# Altium schematic sheet InverterTranslation.SchDoc: Inverter Level Translation
size Letter; Engineer: Nathan Petersen; DocumentNumber: 13; Revision: v1.2; SheetNumber: 13; SheetTotal: 23
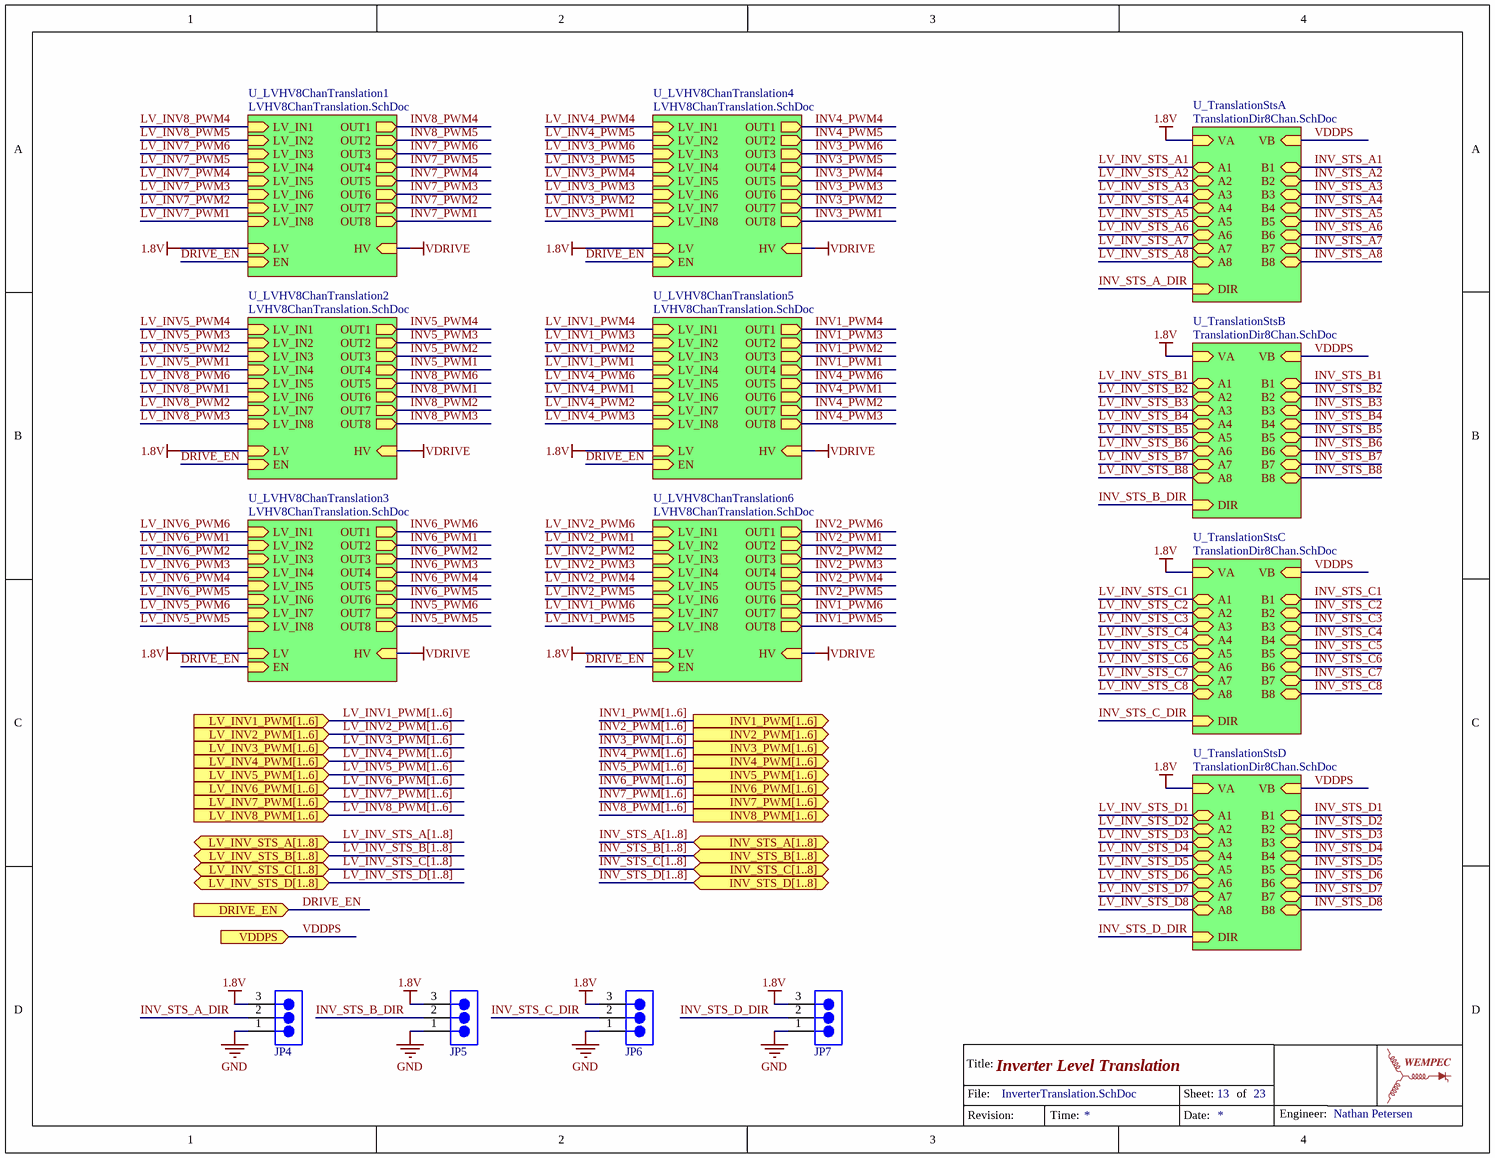
[diagram p0: InverterTranslation.SchDoc]

## Parts
JP4  Jumper3  [PIN_HEADER_1X3]  (value not drawn)
JP5  Jumper3  [PIN_HEADER_1X3]  (value not drawn)
JP6  Jumper3  [PIN_HEADER_1X3]  (value not drawn)
JP7  Jumper3  [PIN_HEADER_1X3]  (value not drawn)

## Sub-sheets
U_LVHV8ChanTranslation1 = LVHV8ChanTranslation.SchDoc: LV_IN1 (in), LV (in), HV (in), EN (in), OUT1 (out), OUT2 (out), OUT3 (out), OUT4 (out), LV_IN2 (in), LV_IN3 (in), LV_IN4 (in), LV_IN5 (in), LV_IN6 (in), LV_IN7 (in), LV_IN8 (in), OUT5 (out), OUT6 (out), OUT7 (out), OUT8 (out)
U_LVHV8ChanTranslation2 = LVHV8ChanTranslation.SchDoc: LV_IN1 (in), LV (in), HV (in), EN (in), OUT1 (out), OUT2 (out), OUT3 (out), OUT4 (out), LV_IN2 (in), LV_IN3 (in), LV_IN4 (in), LV_IN5 (in), LV_IN6 (in), LV_IN7 (in), LV_IN8 (in), OUT5 (out), OUT6 (out), OUT7 (out), OUT8 (out)
U_LVHV8ChanTranslation3 = LVHV8ChanTranslation.SchDoc: LV_IN1 (in), LV (in), HV (in), EN (in), OUT1 (out), OUT2 (out), OUT3 (out), OUT4 (out), LV_IN2 (in), LV_IN3 (in), LV_IN4 (in), LV_IN5 (in), LV_IN6 (in), LV_IN7 (in), LV_IN8 (in), OUT5 (out), OUT6 (out), OUT7 (out), OUT8 (out)
U_LVHV8ChanTranslation4 = LVHV8ChanTranslation.SchDoc: LV_IN1 (in), LV (in), HV (in), EN (in), OUT1 (out), OUT2 (out), OUT3 (out), OUT4 (out), LV_IN2 (in), LV_IN3 (in), LV_IN4 (in), LV_IN5 (in), LV_IN6 (in), LV_IN7 (in), LV_IN8 (in), OUT5 (out), OUT6 (out), OUT7 (out), OUT8 (out)
U_LVHV8ChanTranslation5 = LVHV8ChanTranslation.SchDoc: LV_IN1 (in), LV (in), HV (in), EN (in), OUT1 (out), OUT2 (out), OUT3 (out), OUT4 (out), LV_IN2 (in), LV_IN3 (in), LV_IN4 (in), LV_IN5 (in), LV_IN6 (in), LV_IN7 (in), LV_IN8 (in), OUT5 (out), OUT6 (out), OUT7 (out), OUT8 (out)
U_LVHV8ChanTranslation6 = LVHV8ChanTranslation.SchDoc: LV_IN1 (in), LV (in), HV (in), EN (in), OUT1 (out), OUT2 (out), OUT3 (out), OUT4 (out), LV_IN2 (in), LV_IN3 (in), LV_IN4 (in), LV_IN5 (in), LV_IN6 (in), LV_IN7 (in), LV_IN8 (in), OUT5 (out), OUT6 (out), OUT7 (out), OUT8 (out)
U_TranslationStsA = TranslationDir8Chan.SchDoc: VB (in), VA (in), B1 (bidir), B2 (bidir), B3 (bidir), B4 (bidir), B5 (bidir), B6 (bidir), B7 (bidir), B8 (bidir), A1 (bidir), A2 (bidir), A3 (bidir), A4 (bidir), A5 (bidir), A6 (bidir), A7 (bidir), A8 (bidir), DIR (in)
U_TranslationStsB = TranslationDir8Chan.SchDoc: VB (in), VA (in), B1 (bidir), B2 (bidir), B3 (bidir), B4 (bidir), B5 (bidir), B6 (bidir), B7 (bidir), B8 (bidir), A1 (bidir), A2 (bidir), A3 (bidir), A4 (bidir), A5 (bidir), A6 (bidir), A7 (bidir), A8 (bidir), DIR (in)
U_TranslationStsC = TranslationDir8Chan.SchDoc: VB (in), VA (in), B1 (bidir), B2 (bidir), B3 (bidir), B4 (bidir), B5 (bidir), B6 (bidir), B7 (bidir), B8 (bidir), A1 (bidir), A2 (bidir), A3 (bidir), A4 (bidir), A5 (bidir), A6 (bidir), A7 (bidir), A8 (bidir), DIR (in)
U_TranslationStsD = TranslationDir8Chan.SchDoc: VB (in), VA (in), B1 (bidir), B2 (bidir), B3 (bidir), B4 (bidir), B5 (bidir), B6 (bidir), B7 (bidir), B8 (bidir), A1 (bidir), A2 (bidir), A3 (bidir), A4 (bidir), A5 (bidir), A6 (bidir), A7 (bidir), A8 (bidir), DIR (in)

## Ports
DRIVE_EN (in), INV1_PWM[1..6] (out), INV2_PWM[1..6] (out), INV3_PWM[1..6] (out), INV4_PWM[1..6] (out), INV5_PWM[1..6] (out), INV6_PWM[1..6] (out), INV7_PWM[1..6] (out), INV8_PWM[1..6] (out), INV_STS_A[1..8] (bidir), INV_STS_B[1..8] (bidir), INV_STS_C[1..8] (bidir), INV_STS_D[1..8] (bidir), LV_INV1_PWM[1..6] (in), LV_INV2_PWM[1..6] (in), LV_INV3_PWM[1..6] (in), LV_INV4_PWM[1..6] (in), LV_INV5_PWM[1..6] (in), LV_INV6_PWM[1..6] (in), LV_INV7_PWM[1..6] (in), LV_INV8_PWM[1..6] (in), LV_INV_STS_A[1..8] (bidir), LV_INV_STS_B[1..8] (bidir), LV_INV_STS_C[1..8] (bidir), LV_INV_STS_D[1..8] (bidir), VDDPS (in)

## Nets
1.8V: JP4.3 JP5.3 JP6.3 JP7.3 ; sheet U_LVHV8ChanTranslation1/LV, sheet U_LVHV8ChanTranslation2/LV, sheet U_LVHV8ChanTranslation3/LV, sheet U_LVHV8ChanTranslation4/LV, sheet U_LVHV8ChanTranslation5/LV, sheet U_LVHV8ChanTranslation6/LV, sheet U_TranslationStsA/VA, sheet U_TranslationStsB/VA, sheet U_TranslationStsC/VA, sheet U_TranslationStsD/VA
GND: JP4.1 JP5.1 JP6.1 JP7.1
VDRIVE: sheet U_LVHV8ChanTranslation1/HV, sheet U_LVHV8ChanTranslation2/HV, sheet U_LVHV8ChanTranslation3/HV, sheet U_LVHV8ChanTranslation4/HV, sheet U_LVHV8ChanTranslation5/HV, sheet U_LVHV8ChanTranslation6/HV
DRIVE_EN: port DRIVE_EN, sheet U_LVHV8ChanTranslation1/EN, sheet U_LVHV8ChanTranslation2/EN, sheet U_LVHV8ChanTranslation3/EN, sheet U_LVHV8ChanTranslation4/EN, sheet U_LVHV8ChanTranslation5/EN, sheet U_LVHV8ChanTranslation6/EN
INV1_PWM1: sheet U_LVHV8ChanTranslation5/OUT4
INV1_PWM2: sheet U_LVHV8ChanTranslation5/OUT3
INV1_PWM3: sheet U_LVHV8ChanTranslation5/OUT2
INV1_PWM4: sheet U_LVHV8ChanTranslation5/OUT1
INV1_PWM5: sheet U_LVHV8ChanTranslation6/OUT8
INV1_PWM6: sheet U_LVHV8ChanTranslation6/OUT7
INV2_PWM1: sheet U_LVHV8ChanTranslation6/OUT2
INV2_PWM2: sheet U_LVHV8ChanTranslation6/OUT3
INV2_PWM3: sheet U_LVHV8ChanTranslation6/OUT4
INV2_PWM4: sheet U_LVHV8ChanTranslation6/OUT5
INV2_PWM5: sheet U_LVHV8ChanTranslation6/OUT6
INV2_PWM6: sheet U_LVHV8ChanTranslation6/OUT1
INV3_PWM1: sheet U_LVHV8ChanTranslation4/OUT8
INV3_PWM2: sheet U_LVHV8ChanTranslation4/OUT7
INV3_PWM3: sheet U_LVHV8ChanTranslation4/OUT6
INV3_PWM4: sheet U_LVHV8ChanTranslation4/OUT5
INV3_PWM5: sheet U_LVHV8ChanTranslation4/OUT4
INV3_PWM6: sheet U_LVHV8ChanTranslation4/OUT3
INV4_PWM1: sheet U_LVHV8ChanTranslation5/OUT6
INV4_PWM2: sheet U_LVHV8ChanTranslation5/OUT7
INV4_PWM3: sheet U_LVHV8ChanTranslation5/OUT8
INV4_PWM4: sheet U_LVHV8ChanTranslation4/OUT1
INV4_PWM5: sheet U_LVHV8ChanTranslation4/OUT2
INV4_PWM6: sheet U_LVHV8ChanTranslation5/OUT5
INV5_PWM1: sheet U_LVHV8ChanTranslation2/OUT4
INV5_PWM2: sheet U_LVHV8ChanTranslation2/OUT3
INV5_PWM3: sheet U_LVHV8ChanTranslation2/OUT2
INV5_PWM4: sheet U_LVHV8ChanTranslation2/OUT1
INV5_PWM5: sheet U_LVHV8ChanTranslation3/OUT8
INV5_PWM6: sheet U_LVHV8ChanTranslation3/OUT7
INV6_PWM1: sheet U_LVHV8ChanTranslation3/OUT2
INV6_PWM2: sheet U_LVHV8ChanTranslation3/OUT3
INV6_PWM3: sheet U_LVHV8ChanTranslation3/OUT4
INV6_PWM4: sheet U_LVHV8ChanTranslation3/OUT5
INV6_PWM5: sheet U_LVHV8ChanTranslation3/OUT6
INV6_PWM6: sheet U_LVHV8ChanTranslation3/OUT1
INV7_PWM1: sheet U_LVHV8ChanTranslation1/OUT8
INV7_PWM2: sheet U_LVHV8ChanTranslation1/OUT7
INV7_PWM3: sheet U_LVHV8ChanTranslation1/OUT6
INV7_PWM4: sheet U_LVHV8ChanTranslation1/OUT5
INV7_PWM5: sheet U_LVHV8ChanTranslation1/OUT4
INV7_PWM6: sheet U_LVHV8ChanTranslation1/OUT3
INV8_PWM1: sheet U_LVHV8ChanTranslation2/OUT6
INV8_PWM2: sheet U_LVHV8ChanTranslation2/OUT7
INV8_PWM3: sheet U_LVHV8ChanTranslation2/OUT8
INV8_PWM4: sheet U_LVHV8ChanTranslation1/OUT1
INV8_PWM5: sheet U_LVHV8ChanTranslation1/OUT2
INV8_PWM6: sheet U_LVHV8ChanTranslation2/OUT5
INV_STS_A1: sheet U_TranslationStsA/B1
INV_STS_A2: sheet U_TranslationStsA/B2
INV_STS_A3: sheet U_TranslationStsA/B3
INV_STS_A4: sheet U_TranslationStsA/B4
INV_STS_A5: sheet U_TranslationStsA/B5
INV_STS_A6: sheet U_TranslationStsA/B6
INV_STS_A7: sheet U_TranslationStsA/B7
INV_STS_A8: sheet U_TranslationStsA/B8
INV_STS_A_DIR: JP4.2 ; sheet U_TranslationStsA/DIR
INV_STS_B1: sheet U_TranslationStsB/B1
INV_STS_B2: sheet U_TranslationStsB/B2
INV_STS_B3: sheet U_TranslationStsB/B3
INV_STS_B4: sheet U_TranslationStsB/B4
INV_STS_B5: sheet U_TranslationStsB/B5
INV_STS_B6: sheet U_TranslationStsB/B6
INV_STS_B7: sheet U_TranslationStsB/B7
INV_STS_B8: sheet U_TranslationStsB/B8
INV_STS_B_DIR: JP5.2 ; sheet U_TranslationStsB/DIR
INV_STS_C1: sheet U_TranslationStsC/B1
INV_STS_C2: sheet U_TranslationStsC/B2
INV_STS_C3: sheet U_TranslationStsC/B3
INV_STS_C4: sheet U_TranslationStsC/B4
INV_STS_C5: sheet U_TranslationStsC/B5
INV_STS_C6: sheet U_TranslationStsC/B6
INV_STS_C7: sheet U_TranslationStsC/B7
INV_STS_C8: sheet U_TranslationStsC/B8
INV_STS_C_DIR: JP6.2 ; sheet U_TranslationStsC/DIR
INV_STS_D1: sheet U_TranslationStsD/B1
INV_STS_D2: sheet U_TranslationStsD/B2
INV_STS_D3: sheet U_TranslationStsD/B3
INV_STS_D4: sheet U_TranslationStsD/B4
INV_STS_D5: sheet U_TranslationStsD/B5
INV_STS_D6: sheet U_TranslationStsD/B6
INV_STS_D7: sheet U_TranslationStsD/B7
INV_STS_D8: sheet U_TranslationStsD/B8
INV_STS_D_DIR: JP7.2 ; sheet U_TranslationStsD/DIR
LV_INV1_PWM1: sheet U_LVHV8ChanTranslation5/LV_IN4
LV_INV1_PWM2: sheet U_LVHV8ChanTranslation5/LV_IN3
LV_INV1_PWM3: sheet U_LVHV8ChanTranslation5/LV_IN2
LV_INV1_PWM4: sheet U_LVHV8ChanTranslation5/LV_IN1
LV_INV1_PWM5: sheet U_LVHV8ChanTranslation6/LV_IN8
LV_INV1_PWM6: sheet U_LVHV8ChanTranslation6/LV_IN7
LV_INV2_PWM1: sheet U_LVHV8ChanTranslation6/LV_IN2
LV_INV2_PWM2: sheet U_LVHV8ChanTranslation6/LV_IN3
LV_INV2_PWM3: sheet U_LVHV8ChanTranslation6/LV_IN4
LV_INV2_PWM4: sheet U_LVHV8ChanTranslation6/LV_IN5
LV_INV2_PWM5: sheet U_LVHV8ChanTranslation6/LV_IN6
LV_INV2_PWM6: sheet U_LVHV8ChanTranslation6/LV_IN1
LV_INV3_PWM1: sheet U_LVHV8ChanTranslation4/LV_IN8
LV_INV3_PWM2: sheet U_LVHV8ChanTranslation4/LV_IN7
LV_INV3_PWM3: sheet U_LVHV8ChanTranslation4/LV_IN6
LV_INV3_PWM4: sheet U_LVHV8ChanTranslation4/LV_IN5
LV_INV3_PWM5: sheet U_LVHV8ChanTranslation4/LV_IN4
LV_INV3_PWM6: sheet U_LVHV8ChanTranslation4/LV_IN3
LV_INV4_PWM1: sheet U_LVHV8ChanTranslation5/LV_IN6
LV_INV4_PWM2: sheet U_LVHV8ChanTranslation5/LV_IN7
LV_INV4_PWM3: sheet U_LVHV8ChanTranslation5/LV_IN8
LV_INV4_PWM4: sheet U_LVHV8ChanTranslation4/LV_IN1
LV_INV4_PWM5: sheet U_LVHV8ChanTranslation4/LV_IN2
LV_INV4_PWM6: sheet U_LVHV8ChanTranslation5/LV_IN5
LV_INV5_PWM1: sheet U_LVHV8ChanTranslation2/LV_IN4
LV_INV5_PWM2: sheet U_LVHV8ChanTranslation2/LV_IN3
LV_INV5_PWM3: sheet U_LVHV8ChanTranslation2/LV_IN2
LV_INV5_PWM4: sheet U_LVHV8ChanTranslation2/LV_IN1
LV_INV5_PWM5: sheet U_LVHV8ChanTranslation3/LV_IN8
LV_INV5_PWM6: sheet U_LVHV8ChanTranslation3/LV_IN7
LV_INV6_PWM1: sheet U_LVHV8ChanTranslation3/LV_IN2
LV_INV6_PWM2: sheet U_LVHV8ChanTranslation3/LV_IN3
LV_INV6_PWM3: sheet U_LVHV8ChanTranslation3/LV_IN4
LV_INV6_PWM4: sheet U_LVHV8ChanTranslation3/LV_IN5
LV_INV6_PWM5: sheet U_LVHV8ChanTranslation3/LV_IN6
LV_INV6_PWM6: sheet U_LVHV8ChanTranslation3/LV_IN1
LV_INV7_PWM1: sheet U_LVHV8ChanTranslation1/LV_IN8
LV_INV7_PWM2: sheet U_LVHV8ChanTranslation1/LV_IN7
LV_INV7_PWM3: sheet U_LVHV8ChanTranslation1/LV_IN6
LV_INV7_PWM4: sheet U_LVHV8ChanTranslation1/LV_IN5
LV_INV7_PWM5: sheet U_LVHV8ChanTranslation1/LV_IN4
LV_INV7_PWM6: sheet U_LVHV8ChanTranslation1/LV_IN3
LV_INV8_PWM1: sheet U_LVHV8ChanTranslation2/LV_IN6
LV_INV8_PWM2: sheet U_LVHV8ChanTranslation2/LV_IN7
LV_INV8_PWM3: sheet U_LVHV8ChanTranslation2/LV_IN8
LV_INV8_PWM4: sheet U_LVHV8ChanTranslation1/LV_IN1
LV_INV8_PWM5: sheet U_LVHV8ChanTranslation1/LV_IN2
LV_INV8_PWM6: sheet U_LVHV8ChanTranslation2/LV_IN5
LV_INV_STS_A1: sheet U_TranslationStsA/A1
LV_INV_STS_A2: sheet U_TranslationStsA/A2
LV_INV_STS_A3: sheet U_TranslationStsA/A3
LV_INV_STS_A4: sheet U_TranslationStsA/A4
LV_INV_STS_A5: sheet U_TranslationStsA/A5
LV_INV_STS_A6: sheet U_TranslationStsA/A6
LV_INV_STS_A7: sheet U_TranslationStsA/A7
LV_INV_STS_A8: sheet U_TranslationStsA/A8
LV_INV_STS_B1: sheet U_TranslationStsB/A1
LV_INV_STS_B2: sheet U_TranslationStsB/A2
LV_INV_STS_B3: sheet U_TranslationStsB/A3
LV_INV_STS_B4: sheet U_TranslationStsB/A4
LV_INV_STS_B5: sheet U_TranslationStsB/A5
LV_INV_STS_B6: sheet U_TranslationStsB/A6
LV_INV_STS_B7: sheet U_TranslationStsB/A7
LV_INV_STS_B8: sheet U_TranslationStsB/A8
LV_INV_STS_C1: sheet U_TranslationStsC/A1
LV_INV_STS_C2: sheet U_TranslationStsC/A2
LV_INV_STS_C3: sheet U_TranslationStsC/A3
LV_INV_STS_C4: sheet U_TranslationStsC/A4
LV_INV_STS_C5: sheet U_TranslationStsC/A5
LV_INV_STS_C6: sheet U_TranslationStsC/A6
LV_INV_STS_C7: sheet U_TranslationStsC/A7
LV_INV_STS_C8: sheet U_TranslationStsC/A8
LV_INV_STS_D1: sheet U_TranslationStsD/A1
LV_INV_STS_D2: sheet U_TranslationStsD/A2
LV_INV_STS_D3: sheet U_TranslationStsD/A3
LV_INV_STS_D4: sheet U_TranslationStsD/A4
LV_INV_STS_D5: sheet U_TranslationStsD/A5
LV_INV_STS_D6: sheet U_TranslationStsD/A6
LV_INV_STS_D7: sheet U_TranslationStsD/A7
LV_INV_STS_D8: sheet U_TranslationStsD/A8
VDDPS: port VDDPS, sheet U_TranslationStsA/VB, sheet U_TranslationStsB/VB, sheet U_TranslationStsC/VB, sheet U_TranslationStsD/VB

## Buses and harness runs
bus INV1_PWM[1..6] = port INV1_PWM[1..6]
bus INV2_PWM[1..6] = port INV2_PWM[1..6]
bus INV3_PWM[1..6] = port INV3_PWM[1..6]
bus INV4_PWM[1..6] = port INV4_PWM[1..6]
bus INV5_PWM[1..6] = port INV5_PWM[1..6]
bus INV6_PWM[1..6] = port INV6_PWM[1..6]
bus INV7_PWM[1..6] = port INV7_PWM[1..6]
bus INV8_PWM[1..6] = port INV8_PWM[1..6]
bus INV_STS_A[1..8] = port INV_STS_A[1..8]
bus INV_STS_B[1..8] = port INV_STS_B[1..8]
bus INV_STS_C[1..8] = port INV_STS_C[1..8]
bus INV_STS_D[1..8] = port INV_STS_D[1..8]
bus LV_INV1_PWM[1..6] = port LV_INV1_PWM[1..6]
bus LV_INV2_PWM[1..6] = port LV_INV2_PWM[1..6]
bus LV_INV3_PWM[1..6] = port LV_INV3_PWM[1..6]
bus LV_INV4_PWM[1..6] = port LV_INV4_PWM[1..6]
bus LV_INV5_PWM[1..6] = port LV_INV5_PWM[1..6]
bus LV_INV6_PWM[1..6] = port LV_INV6_PWM[1..6]
bus LV_INV7_PWM[1..6] = port LV_INV7_PWM[1..6]
bus LV_INV8_PWM[1..6] = port LV_INV8_PWM[1..6]
bus LV_INV_STS_A[1..8] = port LV_INV_STS_A[1..8]
bus LV_INV_STS_B[1..8] = port LV_INV_STS_B[1..8]
bus LV_INV_STS_C[1..8] = port LV_INV_STS_C[1..8]
bus LV_INV_STS_D[1..8] = port LV_INV_STS_D[1..8]

## Notes on the sheet
- Title:
- File:
- Sheet:
- of
- Revision:
- Time:
- Date:
- Engineer:

## Library data of the parts
JP4-JP7 = Jumper3: Supplier 1: Digi-Key; Supplier Part Number 1: 732-5316-ND